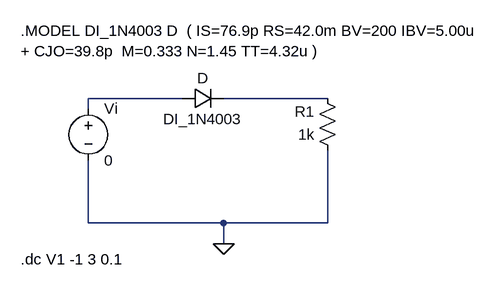
[diagram p0: schematic Simulation_A1.asc]
Simulation_A1.asc, the LTspice schematic file:
Version 4.1
SHEET 1 880 680
WIRE 80 128 -64 128
WIRE 304 128 144 128
WIRE -64 144 -64 128
WIRE -64 320 -64 224
WIRE 144 320 -64 320
WIRE 304 320 304 208
WIRE 304 320 144 320
WIRE 144 352 144 320
FLAG 144 352 0
SYMBOL res 320 224 R180
WINDOW 0 36 76 Left 2
WINDOW 3 36 40 Left 2
SYMATTR InstName R1
SYMATTR Value 1k
SYMBOL diode 80 144 R270
WINDOW 0 32 32 VTop 2
WINDOW 3 0 32 VBottom 2
SYMATTR InstName D
SYMATTR Value DI_1N4003
SYMBOL voltage -64 128 R0
SYMATTR InstName Vi
SYMATTR Value 0
TEXT -168 24 Left 2 !.MODEL DI_1N4003 D  ( IS=76.9p RS=42.0m BV=200 IBV=5.00u\n+ CJO=39.8p  M=0.333 N=1.45 TT=4.32u )
TEXT -168 376 Left 2 !.dc V1 -1 3 0.1

The netlist it stands for:
* Simulation_A1.asc
R1 0 N002 1k
D N001 N002 DI_1N4003
Vi N001 0 0
.model D D
.lib standard.dio
.MODEL DI_1N4003 D  ( IS=76.9p RS=42.0m BV=200 IBV=5.00u
+ CJO=39.8p  M=0.333 N=1.45 TT=4.32u )
.dc V1 -1 3 0.1
.backanno
.end